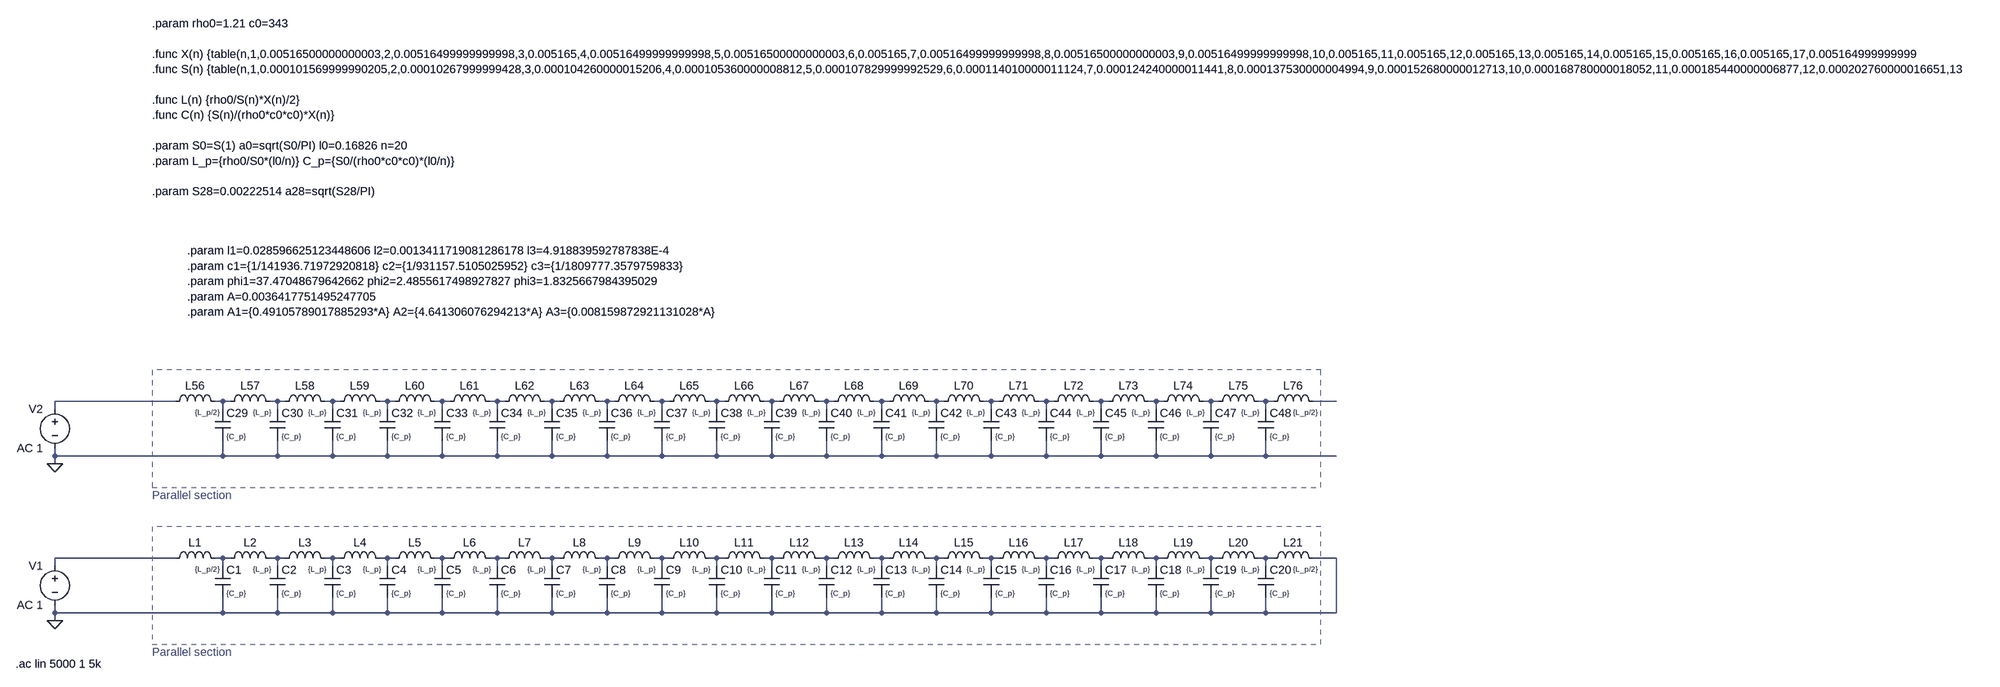
[diagram p0: schematic AC -220722 - Parallel Section.asc]
AC -220722 - Parallel Section.asc, the LTspice schematic file:
Version 4
SHEET 1 12020 680
WIRE -4048 112 -4336 112
WIRE -3952 112 -3968 112
WIRE -3936 112 -3952 112
WIRE -3840 112 -3856 112
WIRE -3824 112 -3840 112
WIRE -3728 112 -3744 112
WIRE -3712 112 -3728 112
WIRE -3616 112 -3632 112
WIRE -3600 112 -3616 112
WIRE -3504 112 -3520 112
WIRE -3488 112 -3504 112
WIRE -3392 112 -3408 112
WIRE -3376 112 -3392 112
WIRE -3280 112 -3296 112
WIRE -3264 112 -3280 112
WIRE -3168 112 -3184 112
WIRE -3152 112 -3168 112
WIRE -3056 112 -3072 112
WIRE -3040 112 -3056 112
WIRE -2944 112 -2960 112
WIRE -2928 112 -2944 112
WIRE -2832 112 -2848 112
WIRE -2816 112 -2832 112
WIRE -2720 112 -2736 112
WIRE -2704 112 -2720 112
WIRE -2608 112 -2624 112
WIRE -2592 112 -2608 112
WIRE -2496 112 -2512 112
WIRE -2480 112 -2496 112
WIRE -2384 112 -2400 112
WIRE -2368 112 -2384 112
WIRE -2272 112 -2288 112
WIRE -2256 112 -2272 112
WIRE -2160 112 -2176 112
WIRE -2144 112 -2160 112
WIRE -2048 112 -2064 112
WIRE -2032 112 -2048 112
WIRE -1936 112 -1952 112
WIRE -1920 112 -1936 112
WIRE -1824 112 -1840 112
WIRE -1808 112 -1824 112
WIRE -1680 112 -1728 112
WIRE -4336 128 -4336 112
WIRE -3952 128 -3952 112
WIRE -3840 128 -3840 112
WIRE -3728 128 -3728 112
WIRE -3616 128 -3616 112
WIRE -3504 128 -3504 112
WIRE -3392 128 -3392 112
WIRE -3280 128 -3280 112
WIRE -3168 128 -3168 112
WIRE -3056 128 -3056 112
WIRE -2944 128 -2944 112
WIRE -2832 128 -2832 112
WIRE -2720 128 -2720 112
WIRE -2608 128 -2608 112
WIRE -2496 128 -2496 112
WIRE -2384 128 -2384 112
WIRE -2272 128 -2272 112
WIRE -2160 128 -2160 112
WIRE -2048 128 -2048 112
WIRE -1936 128 -1936 112
WIRE -1824 128 -1824 112
WIRE -4336 224 -4336 208
WIRE -3952 224 -3952 192
WIRE -3952 224 -4336 224
WIRE -3840 224 -3840 192
WIRE -3840 224 -3952 224
WIRE -3728 224 -3728 192
WIRE -3728 224 -3840 224
WIRE -3616 224 -3616 192
WIRE -3616 224 -3728 224
WIRE -3504 224 -3504 192
WIRE -3504 224 -3616 224
WIRE -3392 224 -3392 192
WIRE -3392 224 -3504 224
WIRE -3280 224 -3280 192
WIRE -3280 224 -3392 224
WIRE -3168 224 -3168 192
WIRE -3168 224 -3280 224
WIRE -3056 224 -3056 192
WIRE -3056 224 -3168 224
WIRE -2944 224 -2944 192
WIRE -2944 224 -3056 224
WIRE -2832 224 -2832 192
WIRE -2832 224 -2944 224
WIRE -2720 224 -2720 192
WIRE -2720 224 -2832 224
WIRE -2608 224 -2608 192
WIRE -2608 224 -2720 224
WIRE -2496 224 -2496 192
WIRE -2496 224 -2608 224
WIRE -2384 224 -2384 192
WIRE -2384 224 -2496 224
WIRE -2272 224 -2272 192
WIRE -2272 224 -2384 224
WIRE -2160 224 -2160 192
WIRE -2160 224 -2272 224
WIRE -2048 224 -2048 192
WIRE -2048 224 -2160 224
WIRE -1936 224 -1936 192
WIRE -1936 224 -2048 224
WIRE -1824 224 -1824 192
WIRE -1824 224 -1936 224
WIRE -1680 224 -1824 224
WIRE -4336 240 -4336 224
WIRE -4048 432 -4336 432
WIRE -3952 432 -3968 432
WIRE -3936 432 -3952 432
WIRE -3840 432 -3856 432
WIRE -3824 432 -3840 432
WIRE -3728 432 -3744 432
WIRE -3712 432 -3728 432
WIRE -3616 432 -3632 432
WIRE -3600 432 -3616 432
WIRE -3504 432 -3520 432
WIRE -3488 432 -3504 432
WIRE -3392 432 -3408 432
WIRE -3376 432 -3392 432
WIRE -3280 432 -3296 432
WIRE -3264 432 -3280 432
WIRE -3168 432 -3184 432
WIRE -3152 432 -3168 432
WIRE -3056 432 -3072 432
WIRE -3040 432 -3056 432
WIRE -2944 432 -2960 432
WIRE -2928 432 -2944 432
WIRE -2832 432 -2848 432
WIRE -2816 432 -2832 432
WIRE -2720 432 -2736 432
WIRE -2704 432 -2720 432
WIRE -2608 432 -2624 432
WIRE -2592 432 -2608 432
WIRE -2496 432 -2512 432
WIRE -2480 432 -2496 432
WIRE -2384 432 -2400 432
WIRE -2368 432 -2384 432
WIRE -2272 432 -2288 432
WIRE -2256 432 -2272 432
WIRE -2160 432 -2176 432
WIRE -2144 432 -2160 432
WIRE -2048 432 -2064 432
WIRE -2032 432 -2048 432
WIRE -1936 432 -1952 432
WIRE -1920 432 -1936 432
WIRE -1824 432 -1840 432
WIRE -1808 432 -1824 432
WIRE -1680 432 -1728 432
WIRE -4336 448 -4336 432
WIRE -3952 448 -3952 432
WIRE -3840 448 -3840 432
WIRE -3728 448 -3728 432
WIRE -3616 448 -3616 432
WIRE -3504 448 -3504 432
WIRE -3392 448 -3392 432
WIRE -3280 448 -3280 432
WIRE -3168 448 -3168 432
WIRE -3056 448 -3056 432
WIRE -2944 448 -2944 432
WIRE -2832 448 -2832 432
WIRE -2720 448 -2720 432
WIRE -2608 448 -2608 432
WIRE -2496 448 -2496 432
WIRE -2384 448 -2384 432
WIRE -2272 448 -2272 432
WIRE -2160 448 -2160 432
WIRE -2048 448 -2048 432
WIRE -1936 448 -1936 432
WIRE -1824 448 -1824 432
WIRE -4336 544 -4336 528
WIRE -3952 544 -3952 512
WIRE -3952 544 -4336 544
WIRE -3840 544 -3840 512
WIRE -3840 544 -3952 544
WIRE -3728 544 -3728 512
WIRE -3728 544 -3840 544
WIRE -3616 544 -3616 512
WIRE -3616 544 -3728 544
WIRE -3504 544 -3504 512
WIRE -3504 544 -3616 544
WIRE -3392 544 -3392 512
WIRE -3392 544 -3504 544
WIRE -3280 544 -3280 512
WIRE -3280 544 -3392 544
WIRE -3168 544 -3168 512
WIRE -3168 544 -3280 544
WIRE -3056 544 -3056 512
WIRE -3056 544 -3168 544
WIRE -2944 544 -2944 512
WIRE -2944 544 -3056 544
WIRE -2832 544 -2832 512
WIRE -2832 544 -2944 544
WIRE -2720 544 -2720 512
WIRE -2720 544 -2832 544
WIRE -2608 544 -2608 512
WIRE -2608 544 -2720 544
WIRE -2496 544 -2496 512
WIRE -2496 544 -2608 544
WIRE -2384 544 -2384 512
WIRE -2384 544 -2496 544
WIRE -2272 544 -2272 512
WIRE -2272 544 -2384 544
WIRE -2160 544 -2160 512
WIRE -2160 544 -2272 544
WIRE -2048 544 -2048 512
WIRE -2048 544 -2160 544
WIRE -1936 544 -1936 512
WIRE -1936 544 -2048 544
WIRE -1824 544 -1824 512
WIRE -1824 544 -1936 544
WIRE -1680 544 -1680 432
WIRE -1680 544 -1824 544
WIRE -4336 560 -4336 544
FLAG -4336 240 0
FLAG -4336 560 0
SYMBOL ind -4064 128 R270
WINDOW 0 32 56 VTop 2
WINDOW 3 4 81 VBottom 1
SYMATTR InstName L56
SYMATTR Value {L_p/2}
SYMBOL cap -3968 128 R0
WINDOW 3 24 56 Left 1
SYMATTR Value {C_p}
SYMATTR InstName C29
SYMBOL ind -3952 128 R270
WINDOW 0 32 56 VTop 2
WINDOW 3 4 81 VBottom 1
SYMATTR InstName L57
SYMATTR Value {L_p}
SYMBOL cap -3856 128 R0
WINDOW 3 24 56 Left 1
SYMATTR Value {C_p}
SYMATTR InstName C30
SYMBOL ind -3840 128 R270
WINDOW 0 32 56 VTop 2
WINDOW 3 4 81 VBottom 1
SYMATTR InstName L58
SYMATTR Value {L_p}
SYMBOL cap -3744 128 R0
WINDOW 3 24 56 Left 1
SYMATTR Value {C_p}
SYMATTR InstName C31
SYMBOL ind -3728 128 R270
WINDOW 0 32 56 VTop 2
WINDOW 3 4 81 VBottom 1
SYMATTR InstName L59
SYMATTR Value {L_p}
SYMBOL cap -3632 128 R0
WINDOW 3 24 56 Left 1
SYMATTR Value {C_p}
SYMATTR InstName C32
SYMBOL ind -3616 128 R270
WINDOW 0 32 56 VTop 2
WINDOW 3 4 81 VBottom 1
SYMATTR InstName L60
SYMATTR Value {L_p}
SYMBOL cap -3520 128 R0
WINDOW 3 24 56 Left 1
SYMATTR Value {C_p}
SYMATTR InstName C33
SYMBOL ind -3504 128 R270
WINDOW 0 32 56 VTop 2
WINDOW 3 4 81 VBottom 1
SYMATTR InstName L61
SYMATTR Value {L_p}
SYMBOL cap -3408 128 R0
WINDOW 3 24 56 Left 1
SYMATTR Value {C_p}
SYMATTR InstName C34
SYMBOL ind -3392 128 R270
WINDOW 0 32 56 VTop 2
WINDOW 3 4 81 VBottom 1
SYMATTR InstName L62
SYMATTR Value {L_p}
SYMBOL cap -3296 128 R0
WINDOW 3 24 56 Left 1
SYMATTR Value {C_p}
SYMATTR InstName C35
SYMBOL ind -3280 128 R270
WINDOW 0 32 56 VTop 2
WINDOW 3 4 81 VBottom 1
SYMATTR InstName L63
SYMATTR Value {L_p}
SYMBOL cap -3184 128 R0
WINDOW 3 24 56 Left 1
SYMATTR Value {C_p}
SYMATTR InstName C36
SYMBOL ind -3168 128 R270
WINDOW 0 32 56 VTop 2
WINDOW 3 4 81 VBottom 1
SYMATTR InstName L64
SYMATTR Value {L_p}
SYMBOL cap -3072 128 R0
WINDOW 3 24 56 Left 1
SYMATTR Value {C_p}
SYMATTR InstName C37
SYMBOL ind -3056 128 R270
WINDOW 0 32 56 VTop 2
WINDOW 3 4 81 VBottom 1
SYMATTR InstName L65
SYMATTR Value {L_p}
SYMBOL cap -2960 128 R0
WINDOW 3 24 56 Left 1
SYMATTR Value {C_p}
SYMATTR InstName C38
SYMBOL ind -2944 128 R270
WINDOW 0 32 56 VTop 2
WINDOW 3 4 81 VBottom 1
SYMATTR InstName L66
SYMATTR Value {L_p}
SYMBOL cap -2848 128 R0
WINDOW 3 24 56 Left 1
SYMATTR Value {C_p}
SYMATTR InstName C39
SYMBOL ind -2832 128 R270
WINDOW 0 32 56 VTop 2
WINDOW 3 4 81 VBottom 1
SYMATTR InstName L67
SYMATTR Value {L_p}
SYMBOL cap -2736 128 R0
WINDOW 3 24 56 Left 1
SYMATTR Value {C_p}
SYMATTR InstName C40
SYMBOL ind -2720 128 R270
WINDOW 0 32 56 VTop 2
WINDOW 3 4 81 VBottom 1
SYMATTR InstName L68
SYMATTR Value {L_p}
SYMBOL cap -2624 128 R0
WINDOW 3 24 56 Left 1
SYMATTR Value {C_p}
SYMATTR InstName C41
SYMBOL ind -2608 128 R270
WINDOW 0 32 56 VTop 2
WINDOW 3 4 81 VBottom 1
SYMATTR InstName L69
SYMATTR Value {L_p}
SYMBOL cap -2512 128 R0
WINDOW 3 24 56 Left 1
SYMATTR Value {C_p}
SYMATTR InstName C42
SYMBOL ind -2496 128 R270
WINDOW 0 32 56 VTop 2
WINDOW 3 4 81 VBottom 1
SYMATTR InstName L70
SYMATTR Value {L_p}
SYMBOL cap -2400 128 R0
WINDOW 3 24 56 Left 1
SYMATTR Value {C_p}
SYMATTR InstName C43
SYMBOL ind -2384 128 R270
WINDOW 0 32 56 VTop 2
WINDOW 3 4 81 VBottom 1
SYMATTR InstName L71
SYMATTR Value {L_p}
SYMBOL cap -2288 128 R0
WINDOW 3 24 56 Left 1
SYMATTR Value {C_p}
SYMATTR InstName C44
SYMBOL ind -2272 128 R270
WINDOW 0 32 56 VTop 2
WINDOW 3 4 81 VBottom 1
SYMATTR InstName L72
SYMATTR Value {L_p}
SYMBOL cap -2176 128 R0
WINDOW 3 24 56 Left 1
SYMATTR Value {C_p}
SYMATTR InstName C45
SYMBOL ind -2160 128 R270
WINDOW 0 32 56 VTop 2
WINDOW 3 4 81 VBottom 1
SYMATTR InstName L73
SYMATTR Value {L_p}
SYMBOL cap -2064 128 R0
WINDOW 3 24 56 Left 1
SYMATTR Value {C_p}
SYMATTR InstName C46
SYMBOL ind -2048 128 R270
WINDOW 0 32 56 VTop 2
WINDOW 3 4 81 VBottom 1
SYMATTR InstName L74
SYMATTR Value {L_p}
SYMBOL cap -1952 128 R0
WINDOW 3 24 56 Left 1
SYMATTR Value {C_p}
SYMATTR InstName C47
SYMBOL ind -1936 128 R270
WINDOW 0 32 56 VTop 2
WINDOW 3 4 81 VBottom 1
SYMATTR InstName L75
SYMATTR Value {L_p}
SYMBOL cap -1840 128 R0
WINDOW 3 24 56 Left 1
SYMATTR Value {C_p}
SYMATTR InstName C48
SYMBOL ind -1824 128 R270
WINDOW 0 32 56 VTop 2
WINDOW 3 4 81 VBottom 1
SYMATTR InstName L76
SYMATTR Value {L_p/2}
SYMBOL voltage -4336 112 M0
SYMATTR InstName V2
SYMATTR Value AC 1
SYMBOL ind -4064 448 R270
WINDOW 0 32 56 VTop 2
WINDOW 3 4 81 VBottom 1
SYMATTR InstName L1
SYMATTR Value {L_p/2}
SYMBOL cap -3968 448 R0
WINDOW 3 24 56 Left 1
SYMATTR Value {C_p}
SYMATTR InstName C1
SYMBOL ind -3952 448 R270
WINDOW 0 32 56 VTop 2
WINDOW 3 4 81 VBottom 1
SYMATTR InstName L2
SYMATTR Value {L_p}
SYMBOL cap -3856 448 R0
WINDOW 3 24 56 Left 1
SYMATTR Value {C_p}
SYMATTR InstName C2
SYMBOL ind -3840 448 R270
WINDOW 0 32 56 VTop 2
WINDOW 3 4 81 VBottom 1
SYMATTR InstName L3
SYMATTR Value {L_p}
SYMBOL cap -3744 448 R0
WINDOW 3 24 56 Left 1
SYMATTR Value {C_p}
SYMATTR InstName C3
SYMBOL ind -3728 448 R270
WINDOW 0 32 56 VTop 2
WINDOW 3 4 81 VBottom 1
SYMATTR InstName L4
SYMATTR Value {L_p}
SYMBOL cap -3632 448 R0
WINDOW 3 24 56 Left 1
SYMATTR Value {C_p}
SYMATTR InstName C4
SYMBOL ind -3616 448 R270
WINDOW 0 32 56 VTop 2
WINDOW 3 4 81 VBottom 1
SYMATTR InstName L5
SYMATTR Value {L_p}
SYMBOL cap -3520 448 R0
WINDOW 3 24 56 Left 1
SYMATTR Value {C_p}
SYMATTR InstName C5
SYMBOL ind -3504 448 R270
WINDOW 0 32 56 VTop 2
WINDOW 3 4 81 VBottom 1
SYMATTR InstName L6
SYMATTR Value {L_p}
SYMBOL cap -3408 448 R0
WINDOW 3 24 56 Left 1
SYMATTR Value {C_p}
SYMATTR InstName C6
SYMBOL ind -3392 448 R270
WINDOW 0 32 56 VTop 2
WINDOW 3 4 81 VBottom 1
SYMATTR InstName L7
SYMATTR Value {L_p}
SYMBOL cap -3296 448 R0
WINDOW 3 24 56 Left 1
SYMATTR Value {C_p}
SYMATTR InstName C7
SYMBOL ind -3280 448 R270
WINDOW 0 32 56 VTop 2
WINDOW 3 4 81 VBottom 1
SYMATTR InstName L8
SYMATTR Value {L_p}
SYMBOL cap -3184 448 R0
WINDOW 3 24 56 Left 1
SYMATTR Value {C_p}
SYMATTR InstName C8
SYMBOL ind -3168 448 R270
WINDOW 0 32 56 VTop 2
WINDOW 3 4 81 VBottom 1
SYMATTR InstName L9
SYMATTR Value {L_p}
SYMBOL cap -3072 448 R0
WINDOW 3 24 56 Left 1
SYMATTR Value {C_p}
SYMATTR InstName C9
SYMBOL ind -3056 448 R270
WINDOW 0 32 56 VTop 2
WINDOW 3 4 81 VBottom 1
SYMATTR InstName L10
SYMATTR Value {L_p}
SYMBOL cap -2960 448 R0
WINDOW 3 24 56 Left 1
SYMATTR Value {C_p}
SYMATTR InstName C10
SYMBOL ind -2944 448 R270
WINDOW 0 32 56 VTop 2
WINDOW 3 4 81 VBottom 1
SYMATTR InstName L11
SYMATTR Value {L_p}
SYMBOL cap -2848 448 R0
WINDOW 3 24 56 Left 1
SYMATTR Value {C_p}
SYMATTR InstName C11
SYMBOL ind -2832 448 R270
WINDOW 0 32 56 VTop 2
WINDOW 3 4 81 VBottom 1
SYMATTR InstName L12
SYMATTR Value {L_p}
SYMBOL cap -2736 448 R0
WINDOW 3 24 56 Left 1
SYMATTR Value {C_p}
SYMATTR InstName C12
SYMBOL ind -2720 448 R270
WINDOW 0 32 56 VTop 2
WINDOW 3 4 81 VBottom 1
SYMATTR InstName L13
SYMATTR Value {L_p}
SYMBOL cap -2624 448 R0
WINDOW 3 24 56 Left 1
SYMATTR Value {C_p}
SYMATTR InstName C13
SYMBOL ind -2608 448 R270
WINDOW 0 32 56 VTop 2
WINDOW 3 4 81 VBottom 1
SYMATTR InstName L14
SYMATTR Value {L_p}
SYMBOL cap -2512 448 R0
WINDOW 3 24 56 Left 1
SYMATTR Value {C_p}
SYMATTR InstName C14
SYMBOL ind -2496 448 R270
WINDOW 0 32 56 VTop 2
WINDOW 3 4 81 VBottom 1
SYMATTR InstName L15
SYMATTR Value {L_p}
SYMBOL cap -2400 448 R0
WINDOW 3 24 56 Left 1
SYMATTR Value {C_p}
SYMATTR InstName C15
SYMBOL ind -2384 448 R270
WINDOW 0 32 56 VTop 2
WINDOW 3 4 81 VBottom 1
SYMATTR InstName L16
SYMATTR Value {L_p}
SYMBOL cap -2288 448 R0
WINDOW 3 24 56 Left 1
SYMATTR Value {C_p}
SYMATTR InstName C16
SYMBOL ind -2272 448 R270
WINDOW 0 32 56 VTop 2
WINDOW 3 4 81 VBottom 1
SYMATTR InstName L17
SYMATTR Value {L_p}
SYMBOL cap -2176 448 R0
WINDOW 3 24 56 Left 1
SYMATTR Value {C_p}
SYMATTR InstName C17
SYMBOL ind -2160 448 R270
WINDOW 0 32 56 VTop 2
WINDOW 3 4 81 VBottom 1
SYMATTR InstName L18
SYMATTR Value {L_p}
SYMBOL cap -2064 448 R0
WINDOW 3 24 56 Left 1
SYMATTR Value {C_p}
SYMATTR InstName C18
SYMBOL ind -2048 448 R270
WINDOW 0 32 56 VTop 2
WINDOW 3 4 81 VBottom 1
SYMATTR InstName L19
SYMATTR Value {L_p}
SYMBOL cap -1952 448 R0
WINDOW 3 24 56 Left 1
SYMATTR Value {C_p}
SYMATTR InstName C19
SYMBOL ind -1936 448 R270
WINDOW 0 32 56 VTop 2
WINDOW 3 4 81 VBottom 1
SYMATTR InstName L20
SYMATTR Value {L_p}
SYMBOL cap -1840 448 R0
WINDOW 3 24 56 Left 1
SYMATTR Value {C_p}
SYMATTR InstName C20
SYMBOL ind -1824 448 R270
WINDOW 0 32 56 VTop 2
WINDOW 3 4 81 VBottom 1
SYMATTR InstName L21
SYMATTR Value {L_p/2}
SYMBOL voltage -4336 432 M0
SYMATTR InstName V1
SYMATTR Value AC 1
TEXT -4096 304 Left 2 ;Parallel section
TEXT -4096 -704 Left 2 !.param rho0=1.21 c0=343\n \n.func X(n) {table(n,1,0.00516500000000003,2,0.00516499999999998,3,0.005165,4,0.00516499999999998,5,0.00516500000000003,6,0.005165,7,0.00516499999999998,8,0.00516500000000003,9,0.00516499999999998,10,0.005165,11,0.005165,12,0.005165,13,0.005165,14,0.005165,15,0.005165,16,0.005165,17,0.00516499999999998,18,0.00516500000000003,19,0.005,20,0.005,21,0.005,22,0.005,23,0.005,24,0.005,25,0.00499999999999995,26,0.005,27,0.005)}\n.func S(n) {table(n,1,0.000101569999990205,2,0.00010267999999428,3,0.000104260000015206,4,0.000105360000008812,5,0.000107829999992529,6,0.000114010000011124,7,0.000124240000011441,8,0.000137530000004994,9,0.000152680000012713,10,0.000168780000018052,11,0.000185440000006877,12,0.000202760000016651,13,0.000221379999987761,14,0.000242350000017738,15,0.000266620000003016,16,0.00029481999997399,17,0.000327350000158122,18,0.000363850000046359,19,0.000406440000084485,20,0.000427330000332941,21,0.000496469999910017,22,0.000592849999906204,23,0.000724820000043707,24,0.000911000000046875,25,0.00116684999984727,26,0.00147168000025428,27,0.0017486199997878)}\n \n.func L(n) {rho0/S(n)*X(n)/2}\n.func C(n) {S(n)/(rho0*c0*c0)*X(n)}\n \n.param S0=S(1) a0=sqrt(S0/PI) l0=0.16826 n=20 \n.param L_p={rho0/S0*(l0/n)} C_p={S0/(rho0*c0*c0)*(l0/n)}\n \n.param S28=0.00222514 a28=sqrt(S28/PI)
TEXT -4024 -240 Left 2 !.param l1=0.028596625123448606 l2=0.0013411719081286178 l3=4.918839592787838E-4\n.param c1={1/141936.71972920818} c2={1/931157.5105025952} c3={1/1809777.3579759833}\n.param phi1=37.47048679642662 phi2=2.4855617498927827 phi3=1.8325667984395029\n.param A=0.0036417751495247705\n.param A1={0.49105789017885293*A} A2={4.641306076294213*A} A3={0.008159872921131028*A}
TEXT -4096 624 Left 2 ;Parallel section
TEXT -4416 648 Left 2 !.ac lin 5000 1 5k
RECTANGLE Normal -4096 288 -1712 48 3
RECTANGLE Normal -4096 608 -1712 368 3

The netlist it stands for:
* AC -220722 - Parallel Section.asc
L56 N001 N002 {L_p/2}
C29 N002 0 {C_p}
L57 N002 N003 {L_p}
C30 N003 0 {C_p}
L58 N003 N004 {L_p}
C31 N004 0 {C_p}
L59 N004 N005 {L_p}
C32 N005 0 {C_p}
L60 N005 N006 {L_p}
C33 N006 0 {C_p}
L61 N006 N007 {L_p}
C34 N007 0 {C_p}
L62 N007 N008 {L_p}
C35 N008 0 {C_p}
L63 N008 N009 {L_p}
C36 N009 0 {C_p}
L64 N009 N010 {L_p}
C37 N010 0 {C_p}
L65 N010 N011 {L_p}
C38 N011 0 {C_p}
L66 N011 N012 {L_p}
C39 N012 0 {C_p}
L67 N012 N013 {L_p}
C40 N013 0 {C_p}
L68 N013 N014 {L_p}
C41 N014 0 {C_p}
L69 N014 N015 {L_p}
C42 N015 0 {C_p}
L70 N015 N016 {L_p}
C43 N016 0 {C_p}
L71 N016 N017 {L_p}
C44 N017 0 {C_p}
L72 N017 N018 {L_p}
C45 N018 0 {C_p}
L73 N018 N019 {L_p}
C46 N019 0 {C_p}
L74 N019 N020 {L_p}
C47 N020 0 {C_p}
L75 N020 N021 {L_p}
C48 N021 0 {C_p}
L76 N021 N022 {L_p/2}
V2 N001 0 AC 1
L1 N023 N024 {L_p/2}
C1 N024 0 {C_p}
L2 N024 N025 {L_p}
C2 N025 0 {C_p}
L3 N025 N026 {L_p}
C3 N026 0 {C_p}
L4 N026 N027 {L_p}
C4 N027 0 {C_p}
L5 N027 N028 {L_p}
C5 N028 0 {C_p}
L6 N028 N029 {L_p}
C6 N029 0 {C_p}
L7 N029 N030 {L_p}
C7 N030 0 {C_p}
L8 N030 N031 {L_p}
C8 N031 0 {C_p}
L9 N031 N032 {L_p}
C9 N032 0 {C_p}
L10 N032 N033 {L_p}
C10 N033 0 {C_p}
L11 N033 N034 {L_p}
C11 N034 0 {C_p}
L12 N034 N035 {L_p}
C12 N035 0 {C_p}
L13 N035 N036 {L_p}
C13 N036 0 {C_p}
L14 N036 N037 {L_p}
C14 N037 0 {C_p}
L15 N037 N038 {L_p}
C15 N038 0 {C_p}
L16 N038 N039 {L_p}
C16 N039 0 {C_p}
L17 N039 N040 {L_p}
C17 N040 0 {C_p}
L18 N040 N041 {L_p}
C18 N041 0 {C_p}
L19 N041 N042 {L_p}
C19 N042 0 {C_p}
L20 N042 N043 {L_p}
C20 N043 0 {C_p}
L21 N043 0 {L_p/2}
V1 N023 0 AC 1
* Parallel section
.param rho0=1.21 c0=343
.func X(n) {table(n,1,0.00516500000000003,2,0.00516499999999998,3,0.005165,4,0.00516499999999998,5,0.00516500000000003,6,0.005165,7,0.00516499999999998,8,0.00516500000000003,9,0.00516499999999998,10,0.005165,11,0.005165,12,0.005165,13,0.005165,14,0.005165,15,0.005165,16,0.005165,17,0.00516499999999998,18,0.00516500000000003,19,0.005,20,0.005,21,0.005,22,0.005,23,0.005,24,0.005,25,0.00499999999999995,26,0.005,27,0.005)}
.func S(n) {table(n,1,0.000101569999990205,2,0.00010267999999428,3,0.000104260000015206,4,0.000105360000008812,5,0.000107829999992529,6,0.000114010000011124,7,0.000124240000011441,8,0.000137530000004994,9,0.000152680000012713,10,0.000168780000018052,11,0.000185440000006877,12,0.000202760000016651,13,0.000221379999987761,14,0.000242350000017738,15,0.000266620000003016,16,0.00029481999997399,17,0.000327350000158122,18,0.000363850000046359,19,0.000406440000084485,20,0.000427330000332941,21,0.000496469999910017,22,0.000592849999906204,23,0.000724820000043707,24,0.000911000000046875,25,0.00116684999984727,26,0.00147168000025428,27,0.0017486199997878)}
.func L(n) {rho0/S(n)*X(n)/2}
.func C(n) {S(n)/(rho0*c0*c0)*X(n)}
.param S0=S(1) a0=sqrt(S0/PI) l0=0.16826 n=20
.param L_p={rho0/S0*(l0/n)} C_p={S0/(rho0*c0*c0)*(l0/n)}
.param S28=0.00222514 a28=sqrt(S28/PI)
.param l1=0.028596625123448606 l2=0.0013411719081286178 l3=4.918839592787838E-4
.param c1={1/141936.71972920818} c2={1/931157.5105025952} c3={1/1809777.3579759833}
.param phi1=37.47048679642662 phi2=2.4855617498927827 phi3=1.8325667984395029
.param A=0.0036417751495247705
.param A1={0.49105789017885293*A} A2={4.641306076294213*A} A3={0.008159872921131028*A}
* Parallel section
.ac lin 5000 1 5k
.backanno
.end